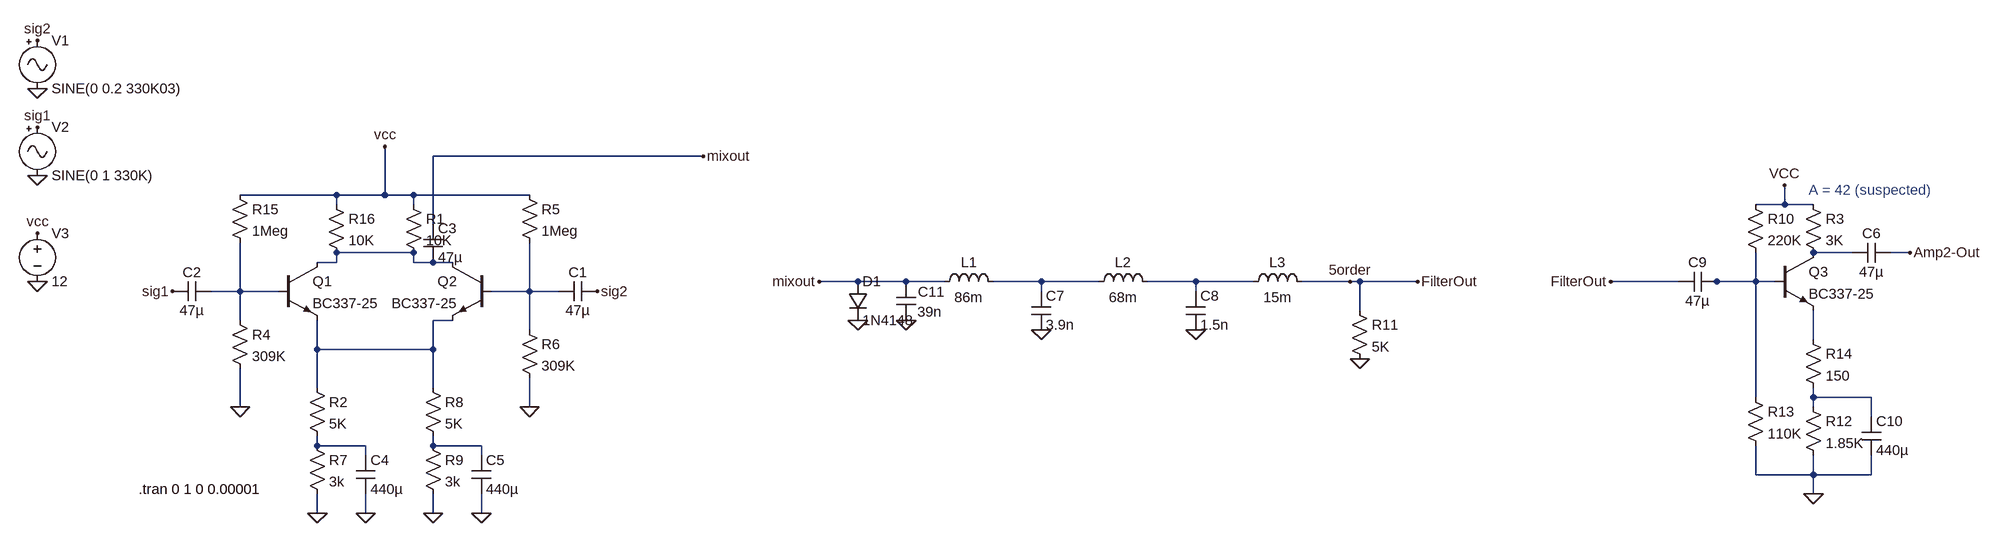
[diagram p0: schematic 007Bullshit.asc]
007Bullshit.asc, the LTspice schematic file:
Version 4
SHEET 1 2872 708
WIRE 736 -48 288 -48
WIRE 128 16 -32 16
WIRE 208 16 208 -64
WIRE 208 16 128 16
WIRE 256 16 208 16
WIRE 448 16 256 16
WIRE 128 32 128 16
WIRE 256 32 256 16
WIRE 2528 32 2528 0
WIRE 2528 32 2480 32
WIRE 2576 32 2528 32
WIRE 288 64 288 -48
WIRE 256 112 128 112
WIRE 2640 112 2576 112
WIRE 2736 112 2704 112
WIRE 128 128 128 112
WIRE 128 128 96 128
WIRE 256 128 256 112
WIRE 288 128 256 128
WIRE 320 128 288 128
WIRE 992 160 928 160
WIRE 1072 160 992 160
WIRE 1136 160 1072 160
WIRE 1296 160 1216 160
WIRE 1392 160 1296 160
WIRE 1552 160 1472 160
WIRE 1648 160 1552 160
WIRE 1808 160 1728 160
WIRE 1824 160 1808 160
WIRE 1920 160 1824 160
WIRE 2352 160 2240 160
WIRE 2416 160 2400 160
WIRE 2480 160 2480 112
WIRE 2480 160 2416 160
WIRE 2512 160 2480 160
WIRE -32 176 -32 96
WIRE -32 176 -80 176
WIRE 32 176 -32 176
WIRE 448 176 448 96
WIRE 448 176 384 176
WIRE 496 176 448 176
WIRE 1296 176 1296 160
WIRE 1552 176 1552 160
WIRE 1824 208 1824 160
WIRE -32 224 -32 176
WIRE 320 224 288 224
WIRE 448 240 448 176
WIRE 2576 256 2576 208
WIRE 96 272 96 224
WIRE 288 272 288 224
WIRE 288 272 96 272
WIRE 96 336 96 272
WIRE 288 336 288 272
WIRE 2480 352 2480 160
WIRE 2576 352 2576 336
WIRE 2672 352 2576 352
WIRE -32 368 -32 304
WIRE 448 368 448 320
WIRE 2576 368 2576 352
WIRE 2672 384 2672 352
WIRE 96 432 96 416
WIRE 176 432 96 432
WIRE 288 432 288 416
WIRE 368 432 288 432
WIRE 176 448 176 432
WIRE 368 448 368 432
WIRE 2480 480 2480 432
WIRE 2576 480 2576 448
WIRE 2576 480 2480 480
WIRE 2672 480 2672 448
WIRE 2672 480 2576 480
WIRE 2576 512 2576 480
WIRE 96 544 96 512
WIRE 176 544 176 512
WIRE 288 544 288 512
WIRE 368 544 368 512
FLAG 448 368 0
FLAG -32 368 0
FLAG -368 160 0
FLAG -368 -16 0
FLAG -368 -160 0
FLAG -368 80 vcc
FLAG -368 -96 sig1
FLAG -144 176 sig1
FLAG -368 -240 sig2
FLAG 560 176 sig2
FLAG 208 -64 vcc
FLAG 96 544 0
FLAG 176 544 0
FLAG 288 544 0
FLAG 368 544 0
FLAG 1920 160 FilterOut
FLAG 2528 0 VCC
FLAG 2736 112 Amp2-Out
FLAG 2240 160 FilterOut
FLAG 1552 240 0
FLAG 1296 240 0
FLAG 1824 288 0
FLAG 1808 160 5order
FLAG 992 224 0
FLAG 2576 512 0
FLAG 1072 224 0
FLAG 736 -48 mixout
FLAG 928 160 mixout
SYMBOL npn 32 128 R0
SYMATTR InstName Q1
SYMATTR Value BC337-25
SYMBOL npn 384 128 M0
SYMATTR InstName Q2
SYMATTR Value BC337-25
SYMBOL res 240 16 R0
SYMATTR InstName R1
SYMATTR Value 10K
SYMBOL res -48 208 R0
SYMATTR InstName R4
SYMATTR Value 309K
SYMBOL res 432 0 R0
SYMATTR InstName R5
SYMATTR Value 1Meg
SYMBOL res 432 224 R0
SYMATTR InstName R6
SYMATTR Value 309K
SYMBOL cap 560 160 R90
WINDOW 0 0 32 VBottom 2
WINDOW 3 32 32 VTop 2
SYMATTR InstName C1
SYMATTR Value 47µ
SYMBOL cap -80 160 R90
WINDOW 0 0 32 VBottom 2
WINDOW 3 32 32 VTop 2
SYMATTR InstName C2
SYMATTR Value 47µ
SYMBOL cap 272 64 R0
SYMATTR InstName C3
SYMATTR Value 47µ
SYMBOL Misc\\signal -368 -256 R0
WINDOW 123 0 0 Left 0
WINDOW 39 0 0 Left 0
SYMATTR InstName V1
SYMATTR Value SINE(0 0.2 330K03)
SYMBOL Misc\\signal -368 -112 R0
WINDOW 123 0 0 Left 0
WINDOW 39 0 0 Left 0
SYMATTR InstName V2
SYMATTR Value SINE(0 1 330K)
SYMBOL voltage -368 64 R0
WINDOW 123 0 0 Left 0
WINDOW 39 0 0 Left 0
SYMATTR InstName V3
SYMATTR Value 12
SYMBOL res 80 320 R0
SYMATTR InstName R2
SYMATTR Value 5K
SYMBOL res 80 416 R0
SYMATTR InstName R7
SYMATTR Value 3k
SYMBOL cap 160 448 R0
SYMATTR InstName C4
SYMATTR Value 440µ
SYMBOL res 272 320 R0
SYMATTR InstName R8
SYMATTR Value 5K
SYMBOL res 272 416 R0
SYMATTR InstName R9
SYMATTR Value 3k
SYMBOL cap 352 448 R0
SYMATTR InstName C5
SYMATTR Value 440µ
SYMBOL npn 2512 112 R0
SYMATTR InstName Q3
SYMATTR Value BC337-25
SYMBOL res 2560 16 R0
SYMATTR InstName R3
SYMATTR Value 3K
SYMBOL res 2464 16 R0
SYMATTR InstName R10
SYMATTR Value 220K
SYMBOL cap 2704 96 R90
WINDOW 0 0 32 VBottom 2
WINDOW 3 32 32 VTop 2
SYMATTR InstName C6
SYMATTR Value 47µ
SYMBOL ind 1120 176 R270
WINDOW 0 32 56 VTop 2
WINDOW 3 5 56 VBottom 2
SYMATTR InstName L1
SYMATTR Value 86m
SYMBOL ind 1376 176 R270
WINDOW 0 32 56 VTop 2
WINDOW 3 5 56 VBottom 2
SYMATTR InstName L2
SYMATTR Value 68m
SYMBOL cap 1280 176 R0
SYMATTR InstName C7
SYMATTR Value 3.9n
SYMBOL cap 1536 176 R0
SYMATTR InstName C8
SYMATTR Value 1.5n
SYMBOL ind 1632 176 R270
WINDOW 0 32 56 VTop 2
WINDOW 3 5 56 VBottom 2
SYMATTR InstName L3
SYMATTR Value 15m
SYMBOL res 1808 192 R0
SYMATTR InstName R11
SYMATTR Value 5K
SYMBOL diode 976 160 R0
SYMATTR InstName D1
SYMATTR Value 1N4148
SYMBOL cap 2416 144 R90
WINDOW 0 0 32 VBottom 2
WINDOW 3 32 32 VTop 2
SYMATTR InstName C9
SYMATTR Value 47µ
SYMBOL res 2560 352 R0
SYMATTR InstName R12
SYMATTR Value 1.85K
SYMBOL res 2464 336 R0
SYMATTR InstName R13
SYMATTR Value 110K
SYMBOL cap 2656 384 R0
SYMATTR InstName C10
SYMATTR Value 440µ
SYMBOL cap 1056 160 R0
WINDOW 0 36 17 Left 2
WINDOW 3 35 50 Left 2
SYMATTR InstName C11
SYMATTR Value 39n
SYMBOL res 2560 240 R0
SYMATTR InstName R14
SYMATTR Value 150
SYMBOL res -48 0 R0
SYMATTR InstName R15
SYMATTR Value 1Meg
SYMBOL res 112 16 R0
SYMATTR InstName R16
SYMATTR Value 10K
TEXT -200 504 Left 2 !.tran 0 1 0 0.00001
TEXT 2568 8 Left 2 ;A = 42 (suspected)

The netlist it stands for:
* 007Bullshit.asc
Q1 N001 N006 N008 0 BC337-25
Q2 N001 N007 N008 0 BC337-25
R1 vcc N001 10K
R4 N006 0 309K
R5 vcc N007 1Meg
R6 N007 0 309K
C1 sig2 N007 47µ
C2 N006 sig1 47µ
C3 mixout N001 47µ
V1 sig2 0 SINE(0 0.2 330K03)
V2 sig1 0 SINE(0 1 330K)
V3 vcc 0 12
R2 N008 N011 5K
R7 N011 0 3k
C4 N011 0 440µ
R8 N008 N012 5K
R9 N012 0 3k
C5 N012 0 440µ
Q3 N002 N005 N009 0 BC337-25
R3 vcc N002 3K
R10 vcc N005 220K
C6 Amp2-Out N002 47µ
L1 mixout N003 86m
L2 N003 N004 68m
C7 N003 0 3.9n
C8 N004 0 1.5n
L3 N004 5order 15m
R11 5order 0 5K
D1 mixout 0 1N4148
C9 N005 5order 47µ
R12 N010 0 1.85K
R13 N005 0 110K
C10 N010 0 440µ
C11 mixout 0 39n
R14 N009 N010 150
R15 vcc N006 1Meg
R16 vcc N001 10K
.model D D
.lib standard.dio
.model NPN NPN
.model PNP PNP
.lib standard.bjt
.tran 0 1 0 0.00001
* A = 42 (suspected)
.backanno
.end